# EAGLE schematic Dock (EAGLE 6.1)
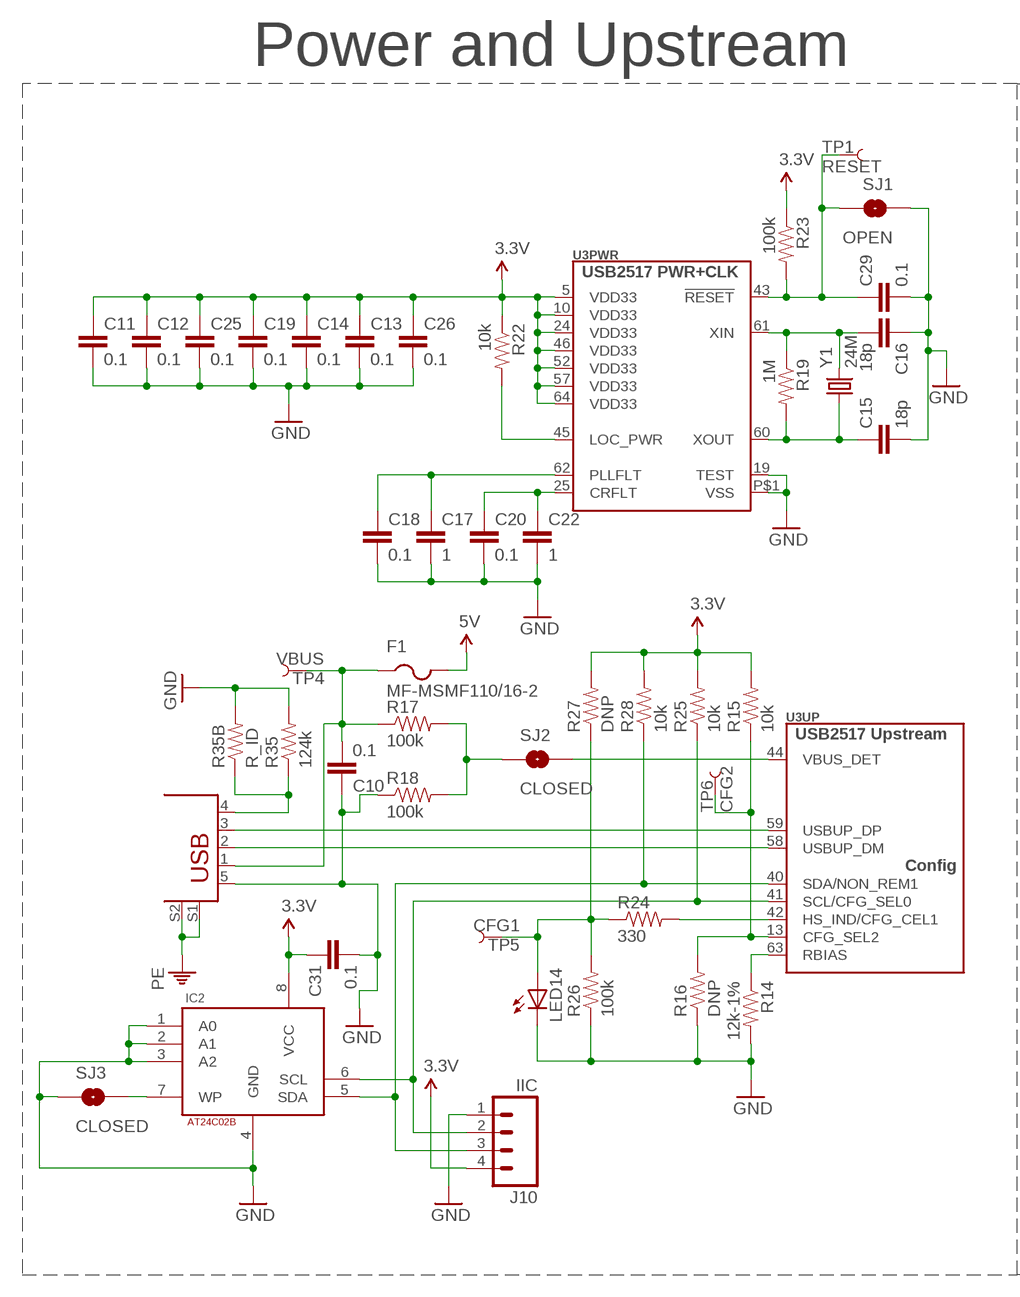
[diagram p0: schematic, sheet 1, part 1 of 2]
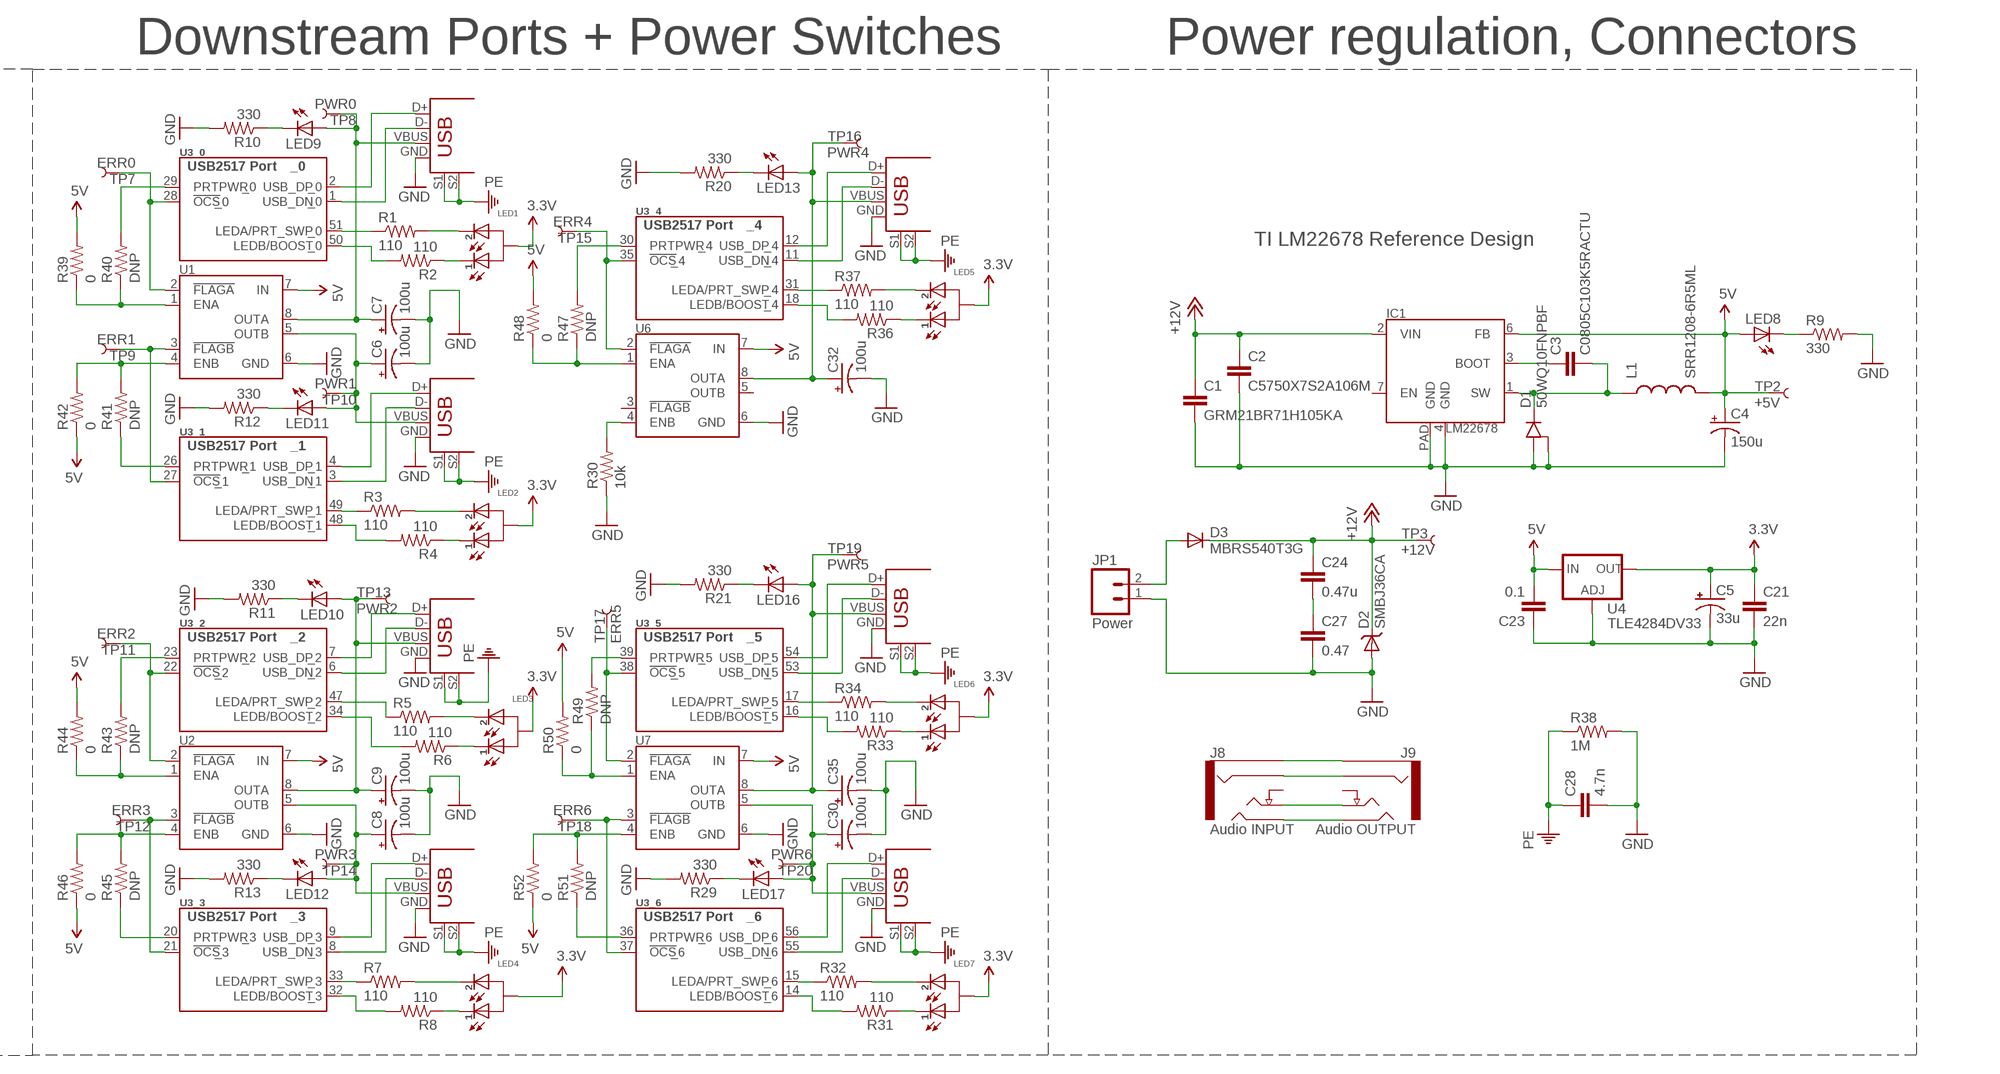
[diagram p1: schematic, sheet 1, part 2 of 2]

## Parts
C1  GRM21BR71H105KA  CAP0805  [0805]
C2  C5750X7S2A106M  CAP2220  [2220]
C3  C0805C103K5RACTU  CAP0805  [0805]
C4  150u  CAP_POLD  [PANASONIC_D]
C5  33u  CAP_POLC  [PANASONIC_C]
C6  100u  CAP_POLD  [PANASONIC_D]
C7  100u  CAP_POLD  [PANASONIC_D]
C8  100u  CAP_POLD  [PANASONIC_D]
C9  100u  CAP_POLD  [PANASONIC_D]
C10  0.1  CAP0402-CAP  [0402-CAP]
C11  0.1  CAP0402-CAP  [0402-CAP]
C12  0.1  CAP0402-CAP  [0402-CAP]
C13  0.1  CAP0402-CAP  [0402-CAP]
C14  0.1  CAP0402-CAP  [0402-CAP]
C15  18p  CAP0402-CAP  [0402-CAP]
C16  18p  CAP0402-CAP  [0402-CAP]
C17  1  CAP0402-CAP  [0402-CAP]
C18  0.1  CAP0402-CAP  [0402-CAP]
C19  0.1  CAP0402-CAP  [0402-CAP]
C20  0.1  CAP0402-CAP  [0402-CAP]
C21  22n  CAP0402-CAP  [0402-CAP]
C22  1  CAP0402-CAP  [0402-CAP]
C23  0.1  CAP0402-CAP  [0402-CAP]
C24  0.47u  CAP0805  [0805]
C25  0.1  CAP0402-CAP  [0402-CAP]
C26  0.1  CAP0402-CAP  [0402-CAP]
C27  0.47  CAP0805  [0805]
C28  4.7n  CAP0805  [0805]
C29  0.1  CAP0402-CAP  [0402-CAP]
C30  100u  CAP_POLD  [PANASONIC_D]
C31  0.1  CAP0402-CAP  [0402-CAP]
C32  100u  CAP_POLD  [PANASONIC_D]
C35  100u  CAP_POLD  [PANASONIC_D]
D1  50WQ10FNPBF  DIODE_COMMON_CAT-DPAK  [V-REG_DPACK]
D2  SMBJ36CA  DIODE-TVS-SMB  [SMB-DIODE]
D3  MBRS540T3G  DIODESMC/DO-214AB  [SMC]
F1  MF-MSMF110/16-2  PTCFUSE-1812  [1812]
IC1  LM22678  [TO-263]
IC2  ATMEL-AT24C02B-SS  [SOIC8]
J0  USB_MINIB_SHIELD-10118193  [10118193]
J1  USB-A-S-RA-VERT  [USB-A-TH-VERT]
J2  USB-A-S-RA-VERT  [USB-A-TH-VERT]
J3  USB-A-S-RA-VERT  [USB-A-TH-VERT]
J4  USB-A-S-RA-VERT  [USB-A-TH-VERT]
J5  USB-A-S-RA-VERT  [USB-A-TH-VERT]
J6  USB-A-S-RA-VERT  [USB-A-TH-VERT]
J7  USB-A-S-RA-VERT  [USB-A-TH-VERT]
J8  Audio INPUT  AUDIO-JACK-4PSWSJ-43515  [SJ-4351X]
J9  Audio OUTPUT  AUDIO-JACK-4PSWSJ-43515  [SJ-4351X]
J10  IIC  M04PTH  [1X04]
JP1  Power  M022-1445055-2  [2-1445055-2]
L1  SRR1208-6R5ML  INDUCTORSRR1208  [SRR1208]
LED1  LED_2X_COMMON_ANODE  [LED_DUAL_3MMX1MM]
LED2  LED_2X_COMMON_ANODE  [LED_DUAL_3MMX1MM]
LED3  LED_2X_COMMON_ANODE  [LED_DUAL_3MMX1MM]
LED4  LED_2X_COMMON_ANODE  [LED_DUAL_3MMX1MM]
LED5  LED_2X_COMMON_ANODE  [LED_DUAL_3MMX1MM]
LED6  LED_2X_COMMON_ANODE  [LED_DUAL_3MMX1MM]
LED7  LED_2X_COMMON_ANODE  [LED_DUAL_3MMX1MM]
LED8  LED0603  [LED-0603]
LED9  LED0603  [LED-0603]
LED10  LED0603  [LED-0603]
LED11  LED0603  [LED-0603]
LED12  LED0603  [LED-0603]
LED13  LED0603  [LED-0603]
LED14  LED0603  [LED-0603]
LED16  LED0603  [LED-0603]
LED17  LED0603  [LED-0603]
R1  110  RESISTOR0402-RES  [0402-RES]
R2  110  RESISTOR0402-RES  [0402-RES]
R3  110  RESISTOR0402-RES  [0402-RES]
R4  110  RESISTOR0402-RES  [0402-RES]
R5  110  RESISTOR0402-RES  [0402-RES]
R6  110  RESISTOR0402-RES  [0402-RES]
R7  110  RESISTOR0402-RES  [0402-RES]
R8  110  RESISTOR0402-RES  [0402-RES]
R9  330  RESISTOR0402-RES  [0402-RES]
R10  330  RESISTOR0402-RES  [0402-RES]
R11  330  RESISTOR0402-RES  [0402-RES]
R12  330  RESISTOR0402-RES  [0402-RES]
R13  330  RESISTOR0402-RES  [0402-RES]
R14  12k-1%  RESISTOR0402-RES  [0402-RES]
R15  10k  RESISTOR0402-RES  [0402-RES]
R16  DNP  RESISTOR0402-RES  [0402-RES]
R17  100k  RESISTOR0402-RES  [0402-RES]
R18  100k  RESISTOR0402-RES  [0402-RES]
R19  1M  RESISTOR0402-RES  [0402-RES]
R20  330  RESISTOR0402-RES  [0402-RES]
R21  330  RESISTOR0402-RES  [0402-RES]
R22  10k  RESISTOR0402-RES  [0402-RES]
R23  100k  RESISTOR0402-RES  [0402-RES]
R24  330  RESISTOR0402-RES  [0402-RES]
R25  10k  RESISTOR0402-RES  [0402-RES]
R26  100k  RESISTOR0402-RES  [0402-RES]
R27  DNP  RESISTOR0402-RES  [0402-RES]
R28  10k  RESISTOR0402-RES  [0402-RES]
R29  330  RESISTOR0402-RES  [0402-RES]
R30  10k  RESISTOR0402-RES  [0402-RES]
R31  110  RESISTOR0402-RES  [0402-RES]
R32  110  RESISTOR0402-RES  [0402-RES]
R33  110  RESISTOR0402-RES  [0402-RES]
R34  110  RESISTOR0402-RES  [0402-RES]
R35  124k  RESISTOR0402-RES  [0402-RES]
R35B  R_ID  RESISTORPTH-1/4W  [AXIAL-0.4]
R36  110  RESISTOR0402-RES  [0402-RES]
R37  110  RESISTOR0402-RES  [0402-RES]
R38  1M  RESISTOR0805-RES  [0805]
R39  0  RESISTOR0402-RES  [0402-RES]
R40  DNP  RESISTOR0402-RES  [0402-RES]
R41  DNP  RESISTOR0402-RES  [0402-RES]
R42  0  RESISTOR0402-RES  [0402-RES]
R43  DNP  RESISTOR0402-RES  [0402-RES]
R44  0  RESISTOR0402-RES  [0402-RES]
R45  DNP  RESISTOR0402-RES  [0402-RES]
R46  0  RESISTOR0402-RES  [0402-RES]
R47  DNP  RESISTOR0402-RES  [0402-RES]
R48  0  RESISTOR0402-RES  [0402-RES]
R49  DNP  RESISTOR0402-RES  [0402-RES]
R50  0  RESISTOR0402-RES  [0402-RES]
R51  DNP  RESISTOR0402-RES  [0402-RES]
R52  0  RESISTOR0402-RES  [0402-RES]
SJ1  OPEN  SOLDERJUMPERNO  [SJ_2S-NO]
SJ2  CLOSED  SOLDERJUMPERTRACE  [SJ_2S-TRACE]
SJ3  CLOSED  SOLDERJUMPERTRACE  [SJ_2S-TRACE]
TP1  RESET  TEST-POINT3  [PAD.03X.03]
TP2  +5V  TEST-POINT3  [PAD.03X.03]
TP3  +12V  TEST-POINT3  [PAD.03X.03]
TP4  VBUS  TEST-POINT3  [PAD.03X.03]
TP5  CFG1  TEST-POINT3  [PAD.03X.03]
TP6  CFG2  TEST-POINT3  [PAD.03X.03]
TP7  ERR0  TEST-POINT3  [PAD.03X.03]
TP8  PWR0  TEST-POINT3  [PAD.03X.03]
TP9  ERR1  TEST-POINT3  [PAD.03X.03]
TP10  PWR1  TEST-POINT3  [PAD.03X.03]
TP11  ERR2  TEST-POINT3  [PAD.03X.03]
TP12  ERR3  TEST-POINT3  [PAD.03X.03]
TP13  PWR2  TEST-POINT3  [PAD.03X.03]
TP14  PWR3  TEST-POINT3  [PAD.03X.03]
TP15  ERR4  TEST-POINT3  [PAD.03X.03]
TP16  PWR4  TEST-POINT3  [PAD.03X.03]
TP17  ERR5  TEST-POINT3  [PAD.03X.03]
TP18  ERR6  TEST-POINT3  [PAD.03X.03]
TP19  PWR5  TEST-POINT3  [PAD.03X.03]
TP20  PWR6  TEST-POINT3  [PAD.03X.03]
U1  MIC2026  [SOIC8]
U2  MIC2026  [SOIC8]
U3  USB2517  [QFN-64-PAD]
U4  TLE4284DV33  V_REG_317DPACK  [V-REG_DPACK]
U6  MIC2026  [SOIC8]
U7  MIC2026  [SOIC8]
Y1  24M  CRYSTAL  [HC49USX]

## Nets
3.3V: C5.+ C11.1 C12.1 C13.1 C14.1 C19.1 C21.1 C25.1 C26.1 C31.1 IC2.8(VCC) J10.4 LED1.1(A) LED2.1(A) LED3.1(A) LED4.1(A) LED5.1(A) LED6.1(A) LED7.1(A) R15.2 R22.1 R23.1 R25.2 R27.2 R28.2 U3.5(PWR:VDD33) U3.10(PWR:VDD33) U3.24(PWR:VDD33) U3.46(PWR:VDD33) U3.52(PWR:VDD33) U3.57(PWR:VDD33) U3.64(PWR:VDD33) U4.4(OUT)
5V: C4.+ C23.2 F1.2 IC1.6(FB) L1.2 LED8.A R39.2 R42.1 R44.2 R46.1 R48.2 R50.2 R52.1 TP2.P$1 U1.7(IN) U2.7(IN) U4.3(IN) U6.7(IN) U7.7(IN)
+12V: C1.1 C2.1 C24.1 D2.C D3.C IC1.2(VIN) TP3.P$1
ENB3: R45.2 R46.2 U2.4(ENB)
ENB6: R51.2 R52.2 U7.4(ENB)
GND: C1.2 C2.2 C4.- C5.- C6.- C7.- C8.- C9.- C10.1 C11.2 C12.2 C13.2 C14.2 C15.2 C16.1 C17.2 C18.2 C19.2 C20.2 C21.2 C22.2 C23.1 C25.2 C26.2 C27.2 C28.2 C29.2 C30.- C31.2 C32.- C35.- D1.1(A) D1.3(A) D2.A IC1.4(GND) IC1.PAD(GND) IC2.1(A0) IC2.2(A1) IC2.3(A2) IC2.4(GND) J0.5(GND) J1.GND J2.GND J3.GND J4.GND J5.GND J6.GND J7.GND J10.1 JP1.1 LED14.C R9.2 R10.2 R11.2 R12.2 R13.2 R14.2 R16.1 R18.1 R20.2 R21.2 R26.1 R29.2 R30.1 R35.2 R35B.P$2 R38.2 SJ1.1 SJ3.1 U1.6(GND) U2.6(GND) U3.19(PWR:TEST) U3.P$1(PWR:VSS) U4.1(ADJ) U6.6(GND) U7.6(GND)
J7: J7.D+ U3.56(_6:USB_DP)
N$1: C20.1 C22.1 U3.25(PWR:CRFLT)
N$2: R22.2 U3.45(PWR:LOC_PWR)
N$3: C17.1 C18.1 U3.62(PWR:PLLFLT)
N$4: C29.1 R23.2 SJ1.2 TP1.P$1 U3.43(PWR:!RESET)
N$5: C15.1 R19.2 U3.60(PWR:XOUT) Y1.P$1
N$6: C16.2 R19.1 U3.61(PWR:XIN) Y1.P$2
N$7: R30.2 U6.4(ENB)
N$8: R17.2 R18.2 SJ2.1
N$9: J1.D- U3.1(_0:USB_DN)
N$10: SJ2.2 U3.44(UP:VBUS_DET)
N$11: C10.2 F1.1 J0.1(VBUS) R17.1 TP4.P$1
N$12: R14.1 U3.63(UP:RBIAS)
N$13: J1.D+ U3.2(_0:USB_DP)
N$14: R2.2 U3.50(_0:LEDB/BOOST)
N$15: R1.1 U3.51(_0:LEDA/PRT_SWP)
N$16: LED1.3(C2) R1.2
N$17: LED1.2(C1) R2.1
N$18: TP7.P$1 U1.2(!FLAGA) U3.28(_0:!OCS)
N$19: R40.2 U3.29(_0:PRTPWR)
N$20: C7.+ J1.VBUS LED9.A TP8.P$1 U1.8(OUTA)
N$21: R41.1 U3.26(_1:PRTPWR)
N$22: TP9.P$1 U1.3(!FLAGB) U3.27(_1:!OCS)
N$23: J2.D- U3.3(_1:USB_DN)
N$24: J2.D+ U3.4(_1:USB_DP)
N$25: C6.+ J2.VBUS LED11.A TP10.P$1 U1.5(OUTB)
N$26: LED2.3(C2) R3.2
N$27: R4.2 U3.48(_1:LEDB/BOOST)
N$28: R3.1 U3.49(_1:LEDA/PRT_SWP)
N$29: LED2.2(C1) R4.1
N$30: J6.D- U3.53(_5:USB_DN)
N$31: J3.D- U3.6(_2:USB_DN)
N$32: J3.D+ U3.7(_2:USB_DP)
N$33: R6.2 U3.34(_2:LEDB/BOOST)
N$34: R5.1 U3.47(_2:LEDA/PRT_SWP)
N$35: LED3.3(C2) R5.2
N$36: LED3.2(C1) R6.1
N$37: LED11.C R12.1
N$38: J4.D- U3.8(_3:USB_DN)
N$39: J4.D+ U3.9(_3:USB_DP)
N$40: C8.+ J4.VBUS LED12.A TP14.P$1 U2.5(OUTB)
N$41: LED4.3(C2) R7.2
N$42: R8.2 U3.32(_3:LEDB/BOOST)
N$43: R7.1 U3.33(_3:LEDA/PRT_SWP)
N$44: LED4.2(C1) R8.1
N$45: TP11.P$1 U2.2(!FLAGA) U3.22(_2:!OCS)
N$46: R43.2 U3.23(_2:PRTPWR)
N$47: D3.A JP1.2
N$48: TP12.P$1 U2.3(!FLAGB) U3.21(_3:!OCS)
N$49: J5.D- U3.11(_4:USB_DN)
N$50: J5.D+ U3.12(_4:USB_DP)
N$51: R36.2 U3.18(_4:LEDB/BOOST)
N$52: R37.1 U3.31(_4:LEDA/PRT_SWP)
N$53: LED5.3(C2) R37.2
N$54: LED5.2(C1) R36.1
N$55: C32.+ J5.VBUS LED13.A TP16.P$1 U6.8(OUTA)
N$56: J6.D+ U3.54(_5:USB_DP)
N$57: R33.2 U3.16(_5:LEDB/BOOST)
N$58: R34.1 U3.17(_5:LEDA/PRT_SWP)
N$59: LED6.3(C2) R34.2
N$60: LED6.2(C1) R33.1
N$61: C35.+ J6.VBUS LED16.A TP19.P$1 U7.8(OUTA)
N$62: J7.D- U3.55(_6:USB_DN)
N$63: J8.3(RING1) J9.3(RING1)
N$64: C30.+ J7.VBUS LED17.A TP20.P$1 U7.5(OUTB)
N$65: LED7.3(C2) R32.2
N$66: R31.2 U3.14(_6:LEDB/BOOST)
N$67: R32.1 U3.15(_6:LEDA/PRT_SWP)
N$68: LED7.2(C1) R31.1
N$69: TP15.P$1 U3.35(_4:!OCS) U6.2(!FLAGA)
N$70: R47.2 U3.30(_4:PRTPWR)
N$71: TP17.P$1 U3.38(_5:!OCS) U7.2(!FLAGA)
N$72: R49.2 U3.39(_5:PRTPWR)
N$74: TP18.P$1 U3.37(_6:!OCS) U7.3(!FLAGB)
N$75: R15.1 R16.2 TP6.P$1 U3.13(UP:CFG_SEL2)
N$76: LED14.A R24.1 R26.2 R27.1 TP5.P$1
N$77: R24.2 U3.42(UP:HS_IND/CFG_CEL1)
N$78: IC2.6(SCL) J10.2 R25.1 U3.41(UP:SCL/CFG_SEL0)
N$79: IC2.5(SDA) J10.3 R28.1 U3.40(UP:SDA/NON_REM1)
N$80: J8.2(TIP) J9.2(TIP)
N$81: R39.1 R40.1 U1.1(ENA)
N$82: C3.1 IC1.3(BOOT)
N$83: J8.4(RING2) J9.4(RING2)
N$84: J8.1(SLEEVE) J9.1(SLEEVE)
N$85: LED8.C R9.1
N$86: LED9.C R10.1
N$87: C9.+ J3.VBUS LED10.A TP13.P$1 U2.8(OUTA)
N$88: LED10.C R11.1
N$89: C24.2 C27.1
N$90: LED12.C R13.1
N$91: LED17.C R29.1
N$92: LED16.C R21.1
N$93: LED13.C R20.1
N$94: J0.4(ID) R35.1 R35B.P$1
N$95: R41.2 R42.2 U1.4(ENB)
N$96: R43.1 R44.1 U2.1(ENA)
N$97: R45.1 U3.20(_3:PRTPWR)
N$98: R47.1 R48.1 U6.1(ENA)
N$99: R49.1 R50.1 U7.1(ENA)
N$100: R51.1 U3.36(_6:PRTPWR)
N$101: IC2.7(WP) SJ3.2
PE: C28.1 J0.S1 J0.S2 J1.S1 J1.S2 J2.S1 J2.S2 J3.S1 J3.S2 J4.S1 J4.S2 J5.S1 J5.S2 J6.S1 J6.S2 J7.S1 J7.S2 R38.1
SW: C3.2 D1.4(C) IC1.1(SW) L1.1
UP_DM: J0.2(D-) U3.58(UP:USBUP_DM)
UP_DP: J0.3(D+) U3.59(UP:USBUP_DP)
Unconnected: IC1.7(EN) J8.5(SWITCH) J9.5(SWITCH) U6.3(!FLAGB) U6.5(OUTB)

## Notes on the sheet
- Power and Upstream | Downstream Ports + Power Switches | Power regulation, Connectors
- TI LM22678 Reference Design

## Library data of the parts
C1-C3 C10-C29 C31 = BUG:CAP: Capacitor Standard 0603 ceramic capacitor, and 0.1" leaded capacitor.
C4-C9 C30 C32 C35 = BUG:CAP_POL: Capacitor Polarized These are standard SMD and PTH capacitors. Normally 10uF, 47uF, and 100uF in electrolytic and tantalum varieties. Always verify the external diameter of the through hole cap, it varies with capacity, voltage, and manufacturer. The EIA devices should be standard.
D1 = BUG:DIODE_COMMON_CAT
D2 = BUG:DIODE-TVS
D3 = SparkFun-DiscreteSemi:DIODE: Diode These are standard reverse protection diodes and small signal diodes. SMA package can handle up to about 1A. SOD-323 can handle about 200mA. What the SOD-323 package when ordering, there are some mfgs out there that are 5-pin packages.
F1 = adafruit:PTCFUSE: PTC fuses, resettable thermistors
IC1 = BUG:LM22678: LM22678 42V 5A Simple Switcher Step-Down Voltage Regulator with internal switch buck 500KHz
IC2 = BUG:ATMEL-AT24C02B
J0 = BUG:USB_MINIB_SHIELD
J1-J7 = BUG:USB-A-S-RA
J8 J9 = BUG:AUDIO-JACK-4PSW
J10 = SparkFun-Connectors:M04: Header 4 Standard 4-pin 0.1" header. Use with straight break away headers (SKU : PRT-00116), right angle break away headers (PRT-00553), swiss pins (PRT-00743), machine pins (PRT-00117), and female headers (PRT-00115). Molex polarized connector foot print use with SKU : PRT-08231 with associated crimp pins and housings. 1MM SMD Version SKU: PRT-10208
JP1 = BUG:M02: Header 2 Standard 2-pin 0.1" header. Use with straight break away headers (SKU : PRT-00116), right angle break away headers (PRT-00553), swiss pins (PRT-00743), machine pins (PRT-00117), and female headers (PRT-00115). Molex polarized connector foot print use with SKU : PRT-08233 with associated crimp pins and housings.
L1 = BUG:INDUCTOR: Inductors Basic Inductor/Choke - 0603 and 1206. Footprints are not proven and vary greatly between part numbers.
LED1-LED7 = BUG:LED_2X_COMMON_ANODE: Dual LED with common anode
LED8-LED14 LED16 LED17 = BUG:LED: LEDs Standard schematic elements and footprints for 5mm, 3mm, 1206, and 0603 sized LEDs. 5mm - Spark Fun Electronics SKU : COM-00529 (and others)
R1-R35 R35B R36-R52 = BUG:RESISTOR: Resistor Basic schematic elements and footprints for 0603, 1206, and PTH resistors.
SJ1-SJ3 = SparkFun-Passives:SOLDERJUMPER: Solder Jumper Standard SMD solder jumper. Used to automate production. Two varients : Normally Open and Normally Closed are the same, but have different paste layers. NC will have a large amount of paste and should jumper during reflow.
TP1-TP20 = BUG:TEST-POINT: Bare copper test points for troubleshooting or ICT
U1 U2 U6 U7 = BUG:MIC2026: Dual-Channel Power Distribution Switch. Appropriate for USB - 500mA continuous 2.7 - 5.5V
U3 = BUG:USB2517: USB2517 SMSC 7 Port USB HUB
U4 = BUG:V_REG_317: Voltage Regulator Standard LM317 adjustable voltage regulator. AOI (Adjust Output Input). Google 'LM317 Calculator' for easy to use app to get the two resistor values needed. 240/720 for 5V output. 240/390 for 3.3V output. Spark Fun Electronics SKU : COM-00527
Y1 = BUG:CRYSTAL: CRYSTAL